# Altium schematic sheet MCU_Module.SchDoc
size A2
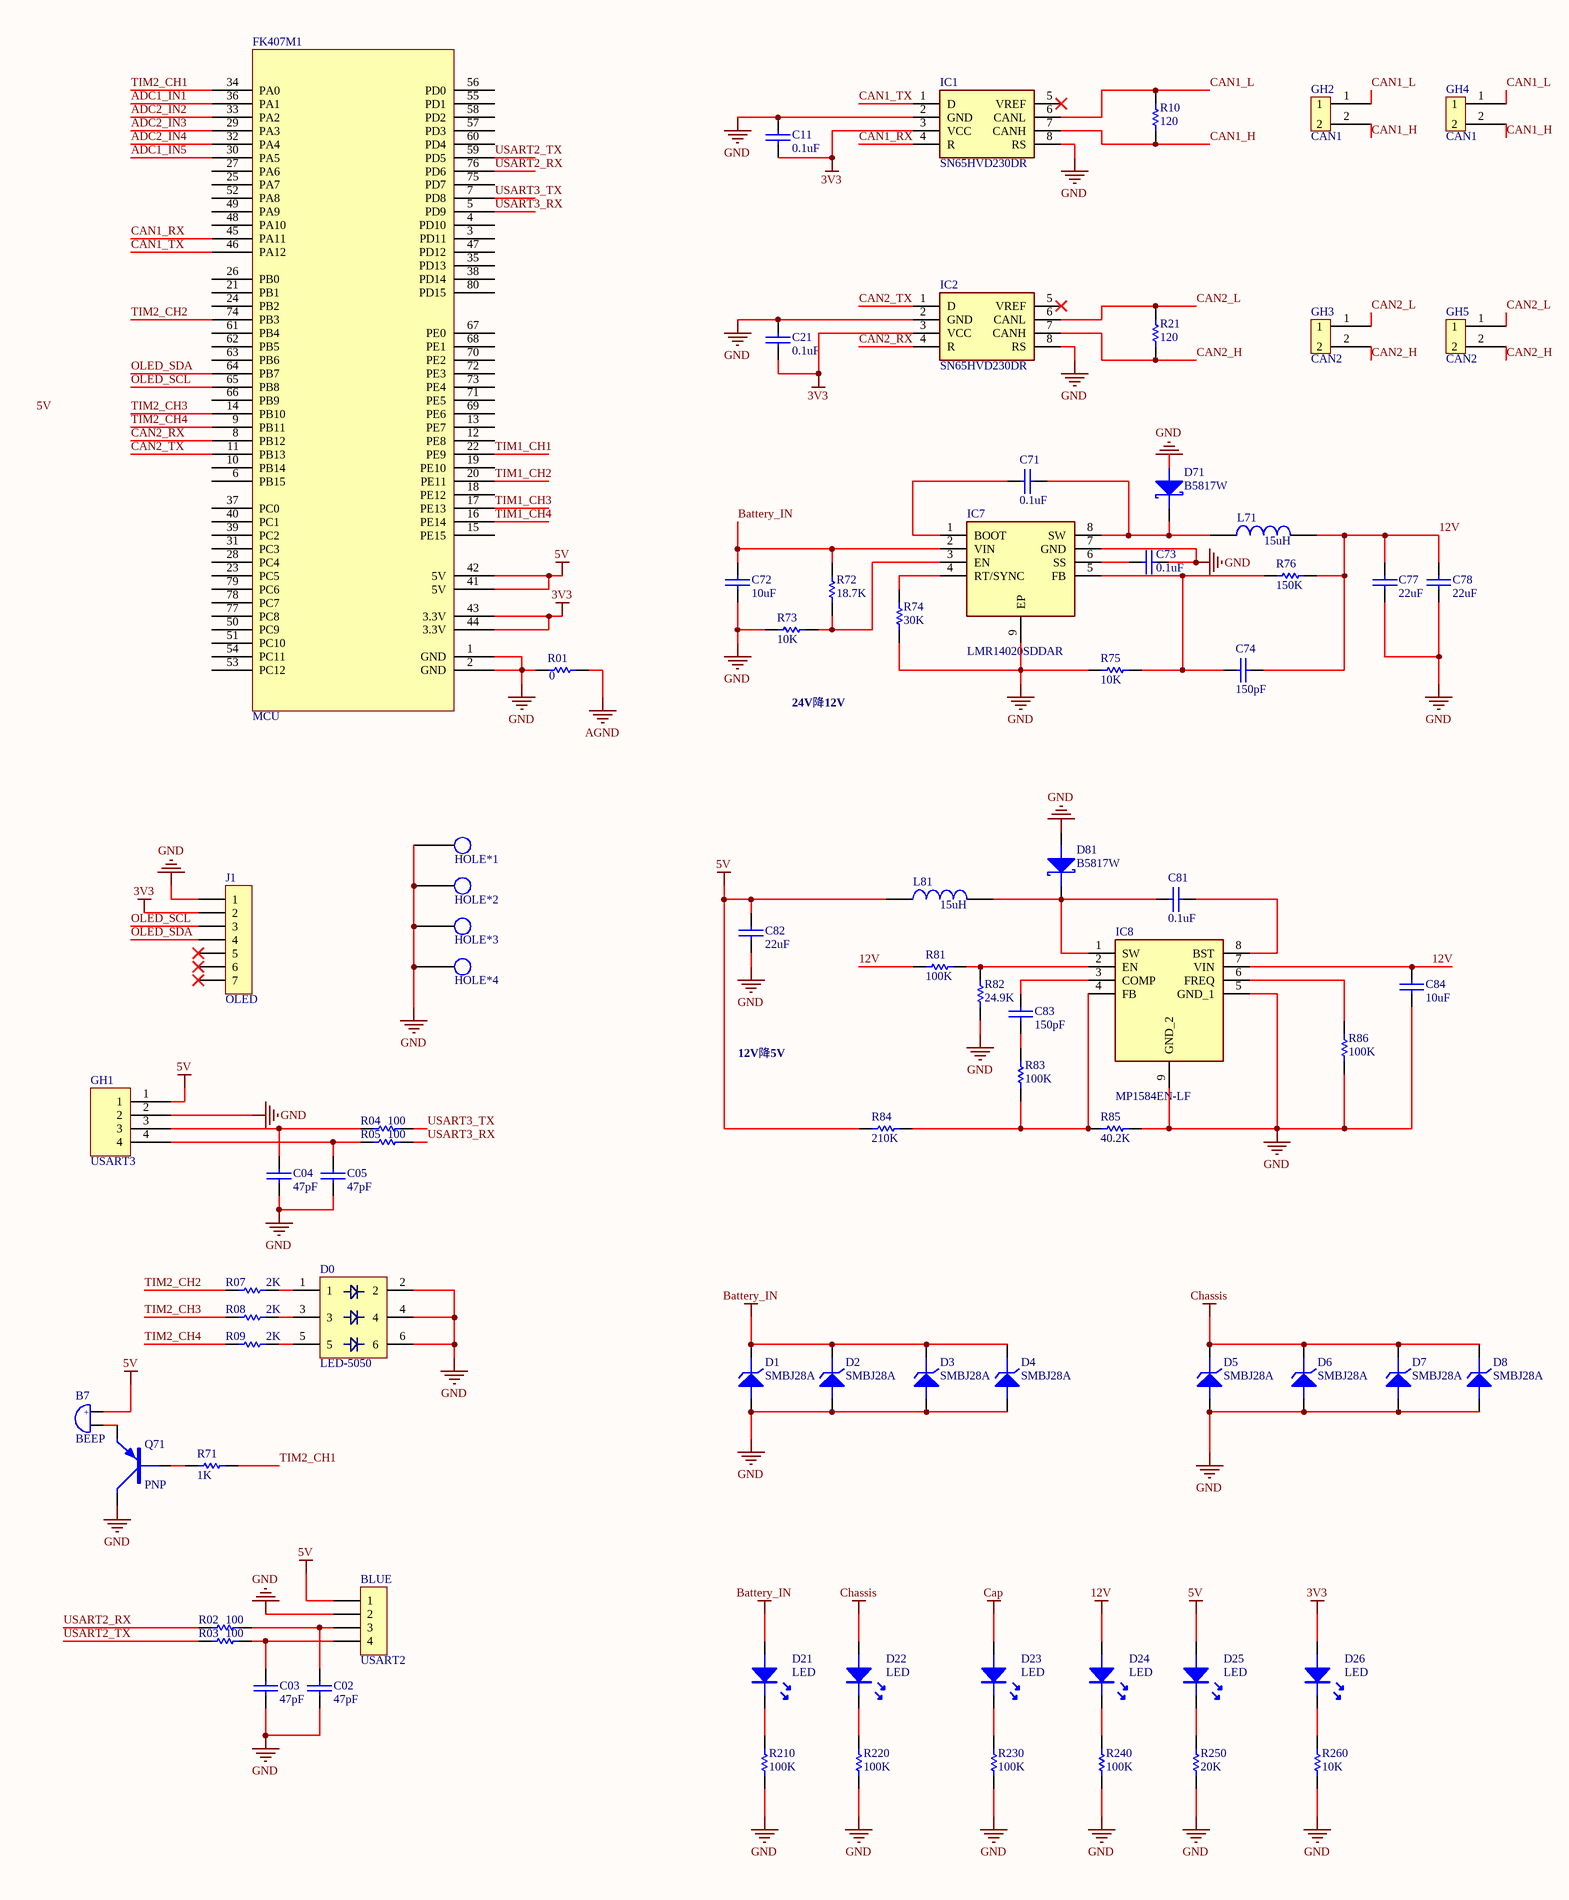
[diagram p0: MCU_Module.SchDoc, left]
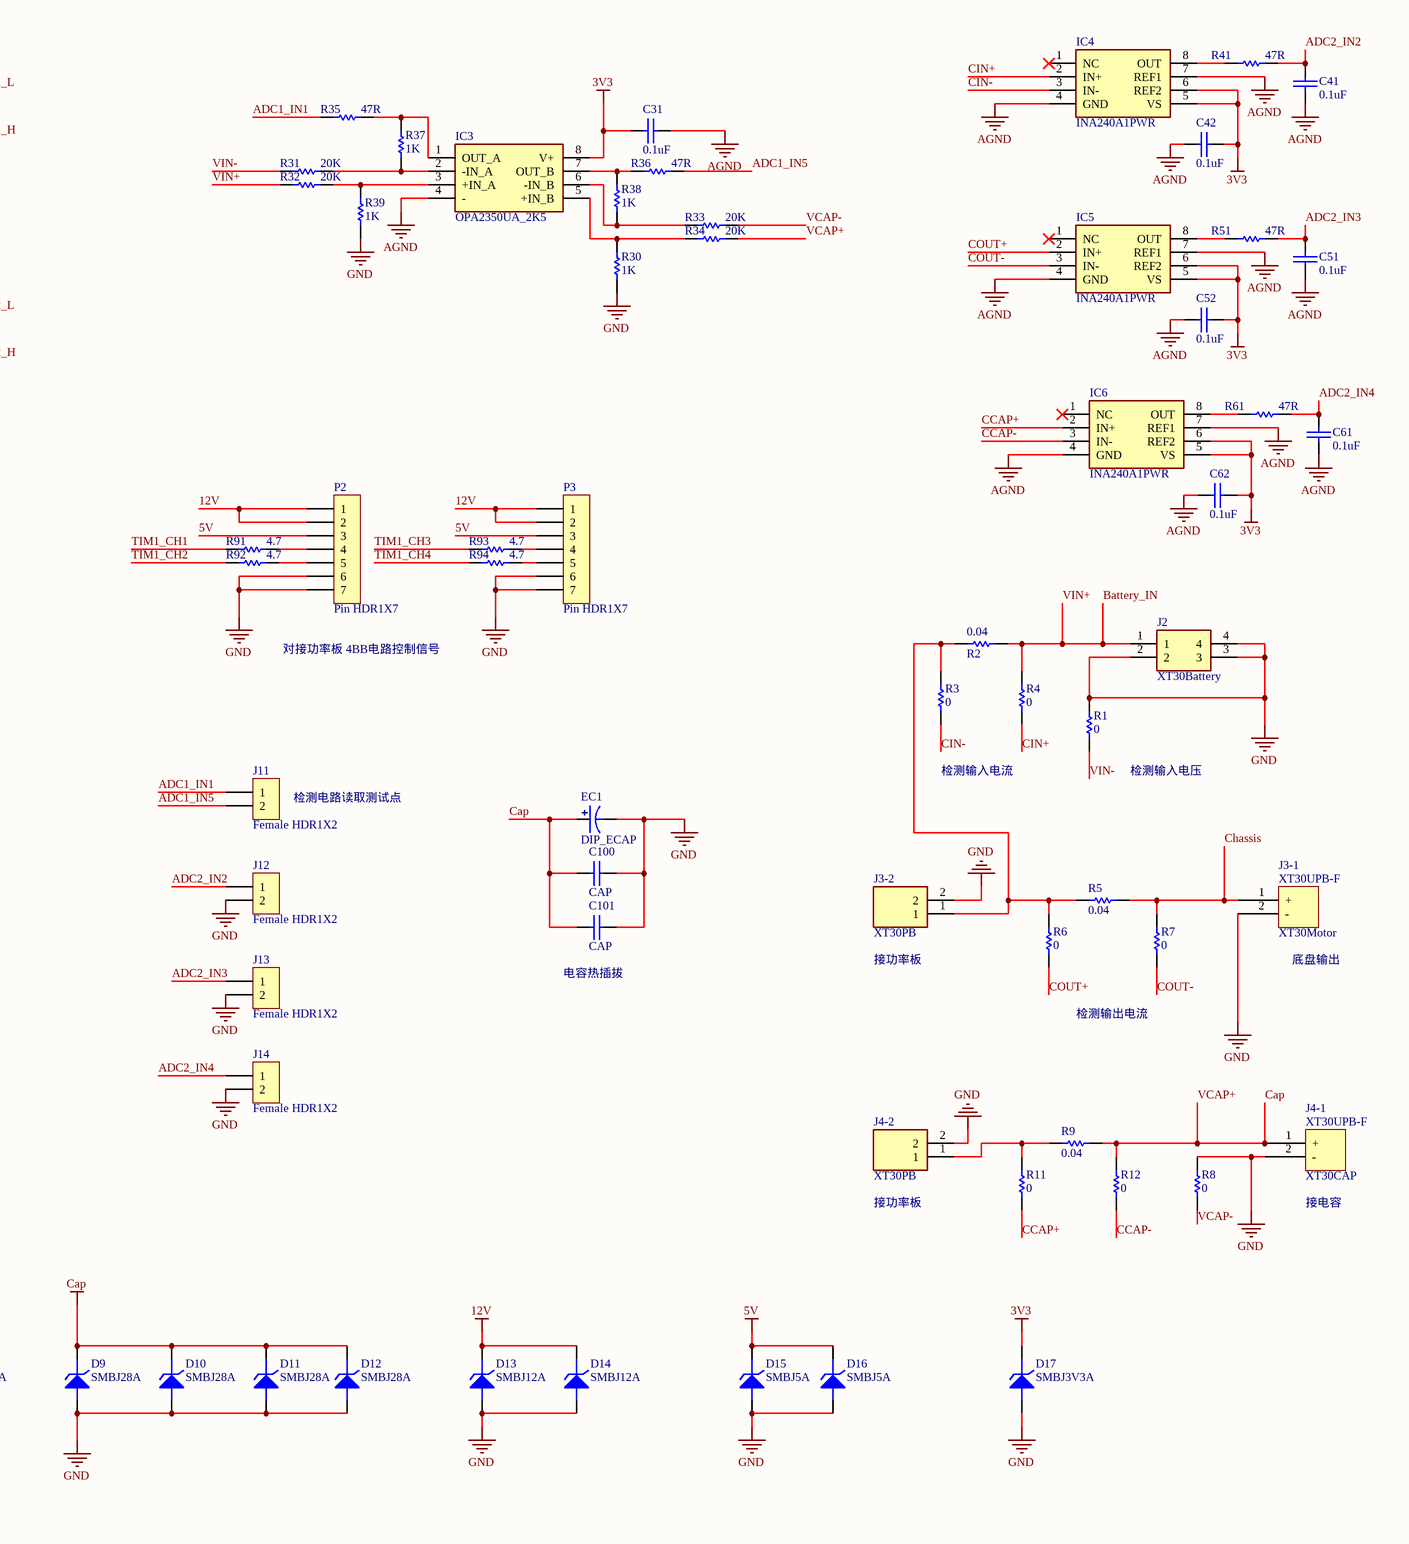
[diagram p1: MCU_Module.SchDoc, right]

## Parts
0.04  R2  [2512R]
B7  BEEP  [BEEP 6.5x12x8.5]
BLUE  USART2  [Fe-HDR1X4/2.54-S]
C02  47pF  [0603C]
C03  47pF  [0603C]
C04  47pF  [0603C]
C05  47pF  [0603C]
C11  0.1uF  [0603C]
C21  0.1uF  [0603C]
C31  0.1uF  [0603C]
C41  0.1uF  [0603C]
C42  0.1uF  [0603C]
C51  0.1uF  [0603C]
C52  0.1uF  [0603C]
C61  0.1uF  [0603C]
C62  0.1uF  [0603C]
C71  0.1uF  [0603C]
C72  10uF  [1206C]
C73  0.1uF  [0603C]
C74  150pF  [0603C]
C77  22uF  [1206C]
C78  22uF  [1206C]
C81  0.1uF  [0603C]
C82  22uF  [1206C]
C83  150pF  [0603C]
C84  10uF  [1206C]
C100  CAP  [1812C]
C101  CAP  [1812C]
D0  LED-5050  [LED-5050W]
D1  SMBJ28A  [SMB/DO-214AA]
D2  SMBJ28A  [SMB/DO-214AA]
D3  SMBJ28A  [SMB/DO-214AA]
D4  SMBJ28A  [SMB/DO-214AA]
D5  SMBJ28A  [SMB/DO-214AA]
D6  SMBJ28A  [SMB/DO-214AA]
D7  SMBJ28A  [SMB/DO-214AA]
D8  SMBJ28A  [SMB/DO-214AA]
D9  SMBJ28A  [SMB/DO-214AA]
D10  SMBJ28A  [SMB/DO-214AA]
D11  SMBJ28A  [SMB/DO-214AA]
D12  SMBJ28A  [SMB/DO-214AA]
D13  SMBJ12A  [SMB/DO-214AA]
D14  SMBJ12A  [SMB/DO-214AA]
D15  SMBJ5A  [SMB/DO-214AA]
D16  SMBJ5A  [SMB/DO-214AA]
D17  SMBJ3V3A  [SMB/DO-214AA]
D21  LED  [LED-0603G]
D22  LED  [LED-0603G]
D23  LED  [LED-0603G]
D24  LED  [LED-0603G]
D25  LED  [LED-0603G]
D26  LED  [LED-0603G]
D71  B5817W  [SMA/DO-214AC]
D81  B5817W  [SMA/DO-214AC]
EC1  DIP_ECAP  [DIP-EC5.0X10X20-A]
FK407M1  MCU  [FK407M1]
GH1  USART3  [GH1.25_4P]
GH2  CAN1  [GH1.25_2P]
GH3  CAN2  [GH1.25_2P]
GH4  CAN1  [GH1.25_2P]
GH5  CAN2  [GH1.25_2P]
HOLE*1  Hole  [M3]  (value not drawn)
HOLE*2  Hole  [M3]  (value not drawn)
HOLE*3  Hole  [M3]  (value not drawn)
HOLE*4  Hole  [M3]  (value not drawn)
IC1  SN65HVD230DR  [SOT127P600X175-8N]
IC2  SN65HVD230DR  [SOT127P600X175-8N]
IC3  OPA2350UA_2K5  [SOIC127P600X175-8N]
IC4  INA240A1PWR  [SOP65P640X120-8N]
IC5  INA240A1PWR  [SOP65P640X120-8N]
IC6  INA240A1PWR  [SOP65P640X120-8N]
IC7  LMR14020SDDAR  [SOIC127P600X170-9N]
IC8  MP1584EN-LF  [SOIC127P600X170-9N]
J1  OLED  [Fe-HDR1X7/2.54-S]
J2  XT30Battery  [XT30PWM]
J3-1  XT30Motor  [XT30UPB-F]
J3-2  XT30PB  [XT30PB]
J4-1  XT30CAP  [XT30UPB-F]
J4-2  XT30PB  [XT30PB]
J11  Female HDR1X2  [Fe-HDR1X2/2.54-S]
J12  Female HDR1X2  [Fe-HDR1X2/2.54-S]
J13  Female HDR1X2  [Fe-HDR1X2/2.54-S]
J14  Female HDR1X2  [Fe-HDR1X2/2.54-S]
L71  15uH  [0630L]
L81  15uH  [0630L]
P2  Pin HDR1X7  [Pin HDR1X7/2.54mm-S]
P3  Pin HDR1X7  [Pin HDR1X7/2.54mm-S]
Q71  PNP  [SOT-23]
R01  0  [0603R]
R1  0  [0603R]
R02  100  [0603R]
R3  0  [0603R]
R03  100  [0603R]
R4  0  [0603R]
R04  100  [0603R]
R5  0.04  [2512R]
R05  100  [0603R]
R6  0  [0603R]
R7  0  [0603R]
R07  2K  [0603R]
R8  0  [0603R]
R08  2K  [0603R]
R9  0.04  [2512R]
R09  2K  [0603R]
R10  120  [0603R]
R11  0  [0603R]
R12  0  [0603R]
R21  120  [0603R]
R30  1K  [0603R]
R31  20K  [0603R]
R32  20K  [0603R]
R33  20K  [0603R]
R34  20K  [0603R]
R35  47R  [0603R]
R36  47R  [0603R]
R37  1K  [0603R]
R38  1K  [0603R]
R39  1K  [0603R]
R41  47R  [0805R]
R51  47R  [0805R]
R61  47R  [0805R]
R71  1K  [0603R]
R72  18.7K  [0603R]
R73  10K  [0603R]
R74  30K  [0603R]
R75  10K  [0603R]
R76  150K  [0603R]
R81  100K  [0603R]
R82  24.9K  [0603R]
R83  100K  [0603R]
R84  210K  [0603R]
R85  40.2K  [0603R]
R86  100K  [0603R]
R91  4.7  [0603R]
R92  4.7  [0603R]
R93  4.7  [0603R]
R94  4.7  [0603R]
R210  100K  [0603R]
R220  100K  [0603R]
R230  100K  [0603R]
R240  100K  [0603R]
R250  20K  [0603R]
R260  10K  [0603R]

## Nets
3V3: C11.1 C21.1 C31.1 C42.2 C52.2 C62.2 D17.K D26.A FK407M1.43(3.3V) FK407M1.44(3.3V) IC1.3(VCC) IC2.3(VCC) IC3.8(V+) IC4.5(VS) IC4.6(REF2) IC5.5(VS) IC5.6(REF2) IC6.5(VS) IC6.6(REF2) J1.2
5V: B7.1 BLUE.1 C82.2 D15.K D16.K D25.A FK407M1.41(5V) FK407M1.42(5V) GH1.1 L81.1 P2.3 P3.3 R84.1
12V: C74.2 C77.2 C78.2 C84.2 D13.K D14.K D24.A IC8.7(VIN) L71.2 P2.1 P2.2 P3.1 P3.2 R76.2 R81.1
AGND: C31.2 C41.2 C42.1 C51.2 C52.1 C61.2 C62.1 IC3.4(-) IC4.4(GND) IC4.7(REF1) IC5.4(GND) IC5.7(REF1) IC6.4(GND) IC6.7(REF1) R01.2
Battery_IN: 0.04.2 C72.2 D1.K D2.K D3.K D4.K D21.A IC7.2(VIN) J2.1 R4.2 R32.1 R72.1  [also labelled VIN+]
Cap: C100.1 C101.1 D9.K D10.K D11.K D12.K D23.A EC1.1 J4-1.1(+) R9.2 R12.2 R34.2  [also labelled VCAP+]
Chassis: D5.K D6.K D7.K D8.K D22.A J3-1.1(+) R5.2 R7.2
GND: BLUE.2 C02.1 C03.1 C04.1 C05.1 C11.2 C21.2 C72.1 C73.2 C77.1 C78.1 C82.1 C84.1 C100.2 C101.2 D0.2 D0.4 D0.6 D1.A D2.A D3.A D4.A D5.A D6.A D7.A D8.A D9.A D10.A D11.A D12.A D13.A D14.A D15.A D16.A D17.A D71.A D81.A EC1.2 FK407M1.1(GND) FK407M1.2(GND) GH1.2 HOLE*1.1 HOLE*2.1 HOLE*3.1 HOLE*4.1 IC1.2(GND) IC1.8(RS) IC2.2(GND) IC2.8(RS) IC7.7(GND) IC7.9(EP) IC8.5(GND_1) IC8.9(GND_2) J1.1 J2.2 J2.3 J2.4 J3-1.2(-) J3-2.2 J4-1.2(-) J4-2.2 J12.2 J13.2 J14.2 P2.6 P2.7 P3.6 P3.7 Q71.C R01.1 R1.2 R8.2 R30.1 R39.1 R73.1 R74.1 R75.1 R82.1 R85.2 R86.1 R210.1 R220.1 R230.1 R240.1 R250.1 R260.1
ADC1_IN1: FK407M1.36(PA1) J11.1 R35.1
ADC1_IN5: FK407M1.30(PA5) J11.2 R36.2
ADC2_IN2: C41.1 FK407M1.33(PA2) J12.1 R41.2
ADC2_IN3: C51.1 FK407M1.29(PA3) J13.1 R51.2
ADC2_IN4: C61.1 FK407M1.32(PA4) J14.1 R61.2
CAN1_H: GH2.2 GH4.2 IC1.7(CANH) R10.1
CAN1_L: GH2.1 GH4.1 IC1.6(CANL) R10.2
CAN1_RX: FK407M1.45(PA11) IC1.4(R)
CAN1_TX: FK407M1.46(PA12) IC1.1(D)
CAN2_H: GH3.2 GH5.2 IC2.7(CANH) R21.1
CAN2_L: GH3.1 GH5.1 IC2.6(CANL) R21.2
CAN2_RX: FK407M1.8(PB12) IC2.4(R)
CAN2_TX: FK407M1.11(PB13) IC2.1(D)
CCAP+: IC6.2(IN+) R11.1
CCAP-: IC6.3(IN-) R12.1
CIN+: IC4.2(IN+) R4.1
CIN-: IC4.3(IN-) R3.1
COUT+: IC5.2(IN+) R6.1
COUT-: IC5.3(IN-) R7.1
OLED_SCL: FK407M1.65(PB8) J1.3
OLED_SDA: FK407M1.64(PB7) J1.4
TIM1_CH1: FK407M1.22(PE9) R91.1
TIM1_CH2: FK407M1.20(PE11) R92.1
TIM1_CH3: FK407M1.17(PE13) R93.1
TIM1_CH4: FK407M1.16(PE14) R94.1
TIM2_CH1: FK407M1.34(PA0) R71.2
TIM2_CH2: FK407M1.74(PB3) R07.1
TIM2_CH3: FK407M1.14(PB10) R08.1
TIM2_CH4: FK407M1.9(PB11) R09.1
USART2_RX: FK407M1.76(PD6) R02.1
USART2_TX: FK407M1.59(PD5) R03.1
USART3_RX: FK407M1.5(PD9) R05.2
USART3_TX: FK407M1.7(PD8) R04.2
VCAP-: R8.1 R33.2
VIN-: R1.1 R31.1
Net0.04_1: 0.04.1 J3-2.1 R3.2 R5.1 R6.2
NetB7_2: B7.2 Q71.E
NetBLUE_3: BLUE.3 C02.2 R02.2
NetBLUE_4: BLUE.4 C03.2 R03.2
NetC04_2: C04.2 GH1.3 R04.1
NetC05_2: C05.2 GH1.4 R05.1
NetC71_1: C71.1 IC7.1(BOOT)
NetC71_2: C71.2 D71.K IC7.8(SW) L71.1
NetC73_1: C73.1 IC7.6(SS)
NetC74_1: C74.1 IC7.5(FB) R75.2 R76.1
NetC81_1: C81.1 D81.K IC8.1(SW) L81.2
NetC81_2: C81.2 IC8.8(BST)
NetC83_1: C83.1 R83.2
NetC83_2: C83.2 IC8.3(COMP)
NetD0_1: D0.1 R07.2
NetD0_3: D0.3 R08.2
NetD0_5: D0.5 R09.2
NetD21_K: D21.K R210.2
NetD22_K: D22.K R220.2
NetD23_K: D23.K R230.2
NetD24_K: D24.K R240.2
NetD25_K: D25.K R250.2
NetD26_K: D26.K R260.2
NetIC3_1: IC3.1(OUT_A) R35.2 R37.2
NetIC3_2: IC3.2(-IN_A) R31.2 R37.1
NetIC3_3: IC3.3(+IN_A) R32.2 R39.2
NetIC3_5: IC3.5(+IN_B) R30.2 R34.1
NetIC3_6: IC3.6(-IN_B) R33.1 R38.1
NetIC3_7: IC3.7(OUT_B) R36.1 R38.2
NetIC4_8: IC4.8(OUT) R41.1
NetIC5_8: IC5.8(OUT) R51.1
NetIC6_8: IC6.8(OUT) R61.1
NetIC7_3: IC7.3(EN) R72.2 R73.2
NetIC7_4: IC7.4(RT/SYNC) R74.2
NetIC8_2: IC8.2(EN) R81.2 R82.2
NetIC8_4: IC8.4(FB) R83.1 R84.2 R85.1
NetIC8_6: IC8.6(FREQ) R86.2
NetJ4-2_1: J4-2.1 R9.1 R11.2
NetP2_4: P2.4 R91.2
NetP2_5: P2.5 R92.2
NetP3_4: P3.4 R93.2
NetP3_5: P3.5 R94.2
NetQ71_B: Q71.B R71.1

Not connected (* = marked no-connect by the designer): FK407M1 3(PD11) 4(PD10) 6(PB15) 10(PB14) 12(PE8) 13(PE7) 15(PE15) 18(PE12) 19(PE10) 21(PB1) 23(PC5) 24(PB2) 25(PA7) 26(PB0) 27(PA6) 28(PC4) 31(PC3) 35(PD13) 37(PC0) 38(PD14) 39(PC2) 40(PC1) 47(PD12) 48(PA10) 49(PA9) 50(PC9) 51(PC10) 52(PA8) 53(PC12) 54(PC11) 55(PD1) 56(PD0) 57(PD3) 58(PD2) 60(PD4) 61(PB4) 62(PB5) 63(PB6) 66(PB9) 67(PE0) 68(PE1) 69(PE6) 70(PE2) 71(PE5) 72(PE3) 73(PE4) 75(PD7) 77(PC8) 78(PC7) 79(PC6) 80(PD15); IC1 5(VREF)*; IC2 5(VREF)*; IC4 1(NC)*; IC5 1(NC)*; IC6 1(NC)*; J1 5* 6* 7*

## Notes on the sheet
- 对接功率板 4BB电路控制信号
- 24V降12V
- 检测输入电流
- (near R1) 检测输入电压
- (near J11) 检测电路读取测试点
- (near C101) 电容热插拔
- (near J3-2) 接功率板
- (near J3-1) 底盘输出
- 12V降5V
- 检测输出电流
- (near J4-2) 接功率板
- (near J4-1) 接电容
- Labels drawn without touching a wire or pin: 5V
- (in symbol BEEP) +

## Library data of the parts
0.04 R01 R1 R02 R3 R03 R4 R04 R5 R05-R7 R07 R8 R08 R9 R09-R12 R21 R30-R39 R41 R51 R61 R71-R76 R81-R86 R91-R94 R210 R220 R230 R240 R250 R260 = RES
B7 = BEEP: 蜂鸣器
BLUE = Female HDR1X4
C02 C03 C04 C05 C11 C21 C31 C41 C42 C51 C52 C61 C62 C71-C74 C77 C78 C81-C84 C100 C101 = CAP: 无极性电容
D1-D17 = DIODE ZENER: 稳压二极管
D71 D81 = DIODE SCHOTTKY: 肖特基二极管
EC1 = DIP_ECAP: 直插电解电容
FK407M1 = FK407M1
GH1 = GH1.25_4P
GH2-GH5 = GH1.25_2P
IC1 IC2 = SN65HVD230DR: Integrated Circuit; Manufacturer_Name: Texas Instruments; Datasheet Link: http://www.ti.com/lit/gpn/sn65hvd230; Height: 1.75mm; Manufacturer_Part_Number: SN65HVD230DR; Mouser Part Number: 595-SN65HVD230DR; Mouser Price/Stock: https://www.mouser.co.uk/ProductDetail/Texas-Instruments/SN65HVD230DR?qs=QViXGNcIEAtifeQR3pYVUQ%3D%3D; Arrow Part Number: SN65HVD230DR; Arrow Price/Stock: https://www.arrow.com/en/products/sn65hvd230dr/texas-instruments?region=nac
IC3 = OPA2350UA_2K5: Integrated Circuit; Manufacturer_Name: Texas Instruments; Manufacturer_Part_Number: OPA2350UA/2K5; Datasheet Link: http://www.ti.com/lit/gpn/opa2350; Height: 1.75mm; Mouser Part Number: 595-OPA2350UA/2K5; Mouser Price/Stock: https://www.mouser.co.uk/ProductDetail/Texas-Instruments/OPA2350UA-2K5?qs=7nS3%252BbEUL6t75JUF5jEhbw%3D%3D; Arrow Part Number: OPA2350UA/2K5; Arrow Price/Stock: https://www.arrow.com/en/products/opa2350ua2k5/texas-instruments
IC4-IC6 = INA240A1PWR: Integrated Circuit; Manufacturer_Name: Texas Instruments; Datasheet Link: http://www.ti.com/lit/gpn/INA240; Height: 1.2mm; Manufacturer_Part_Number: INA240A1PWR; Mouser Part Number: 595-INA240A1PWR; Mouser Price/Stock: https://www.mouser.co.uk/ProductDetail/Texas-Instruments/INA240A1PWR?qs=aVyJF2WnouTDXnRi6tpqfA%3D%3D; Arrow Part Number: INA240A1PWR; Arrow Price/Stock: https://www.arrow.com/en/products/ina240a1pwr/texas-instruments?region=nac
IC7 = LMR14020SDDAR: Integrated Circuit; Manufacturer_Name: Texas Instruments; Datasheet Link: http://www.ti.com/lit/gpn/lmr14020; Height: 1.7mm; Manufacturer_Part_Number: LMR14020SDDAR; Mouser Part Number: 595-LMR14020SDDAR; Mouser Price/Stock: https://www.mouser.co.uk/ProductDetail/Texas-Instruments/LMR14020SDDAR?qs=Q2snjRlG%2FBLpJ6bVOizpDA%3D%3D; Arrow Part Number: LMR14020SDDAR; Arrow Price/Stock: https://www.arrow.com/en/products/lmr14020sddar/texas-instruments
IC8 = MP1584EN-LF: Integrated Circuit; Manufacturer_Name: Monolithic Power Systems (MPS); Datasheet Link: https://componentsearchengine.com/Datasheets/1/MP1584EN-LF.pdf; Height: 1.7mm; Manufacturer_Part_Number: MP1584EN-LF; Mouser Part Number: 946-MP1584ENLF; Mouser Price/Stock: https://www.mouser.com/Search/Refine.aspx?Keyword=946-MP1584ENLF
J1 = Female HDR1X7
J2 = XT30PW-M: Connector; Manufacturer_Name: Amass; Datasheet Link: https://www.tme.eu/sl/Document/ce4077e36b79046da520ca73227e15de/XT30PW%20SPEC.pdf; Height: 5mm; Manufacturer_Part_Number: XT30PW-M
J3-1 J4-1 = XT30UPB-F
J3-2 J4-2 = XT30PB: Connector; Manufacturer_Name: Amass; Datasheet Link: https://www.tme.eu/Document/4acc913878197f8c2e30d4b8cdc47230/XT30UPB%20SPEC.pdf; Height: 10.7mm; Manufacturer_Part_Number: XT30PB
L71 L81 = INDUCTOR
Q71 = PNP: PNP三极管